# EasyEDA Pro project ProProject_nRF52840无线键盘_2024-02-15.epro, board PCB_JLC
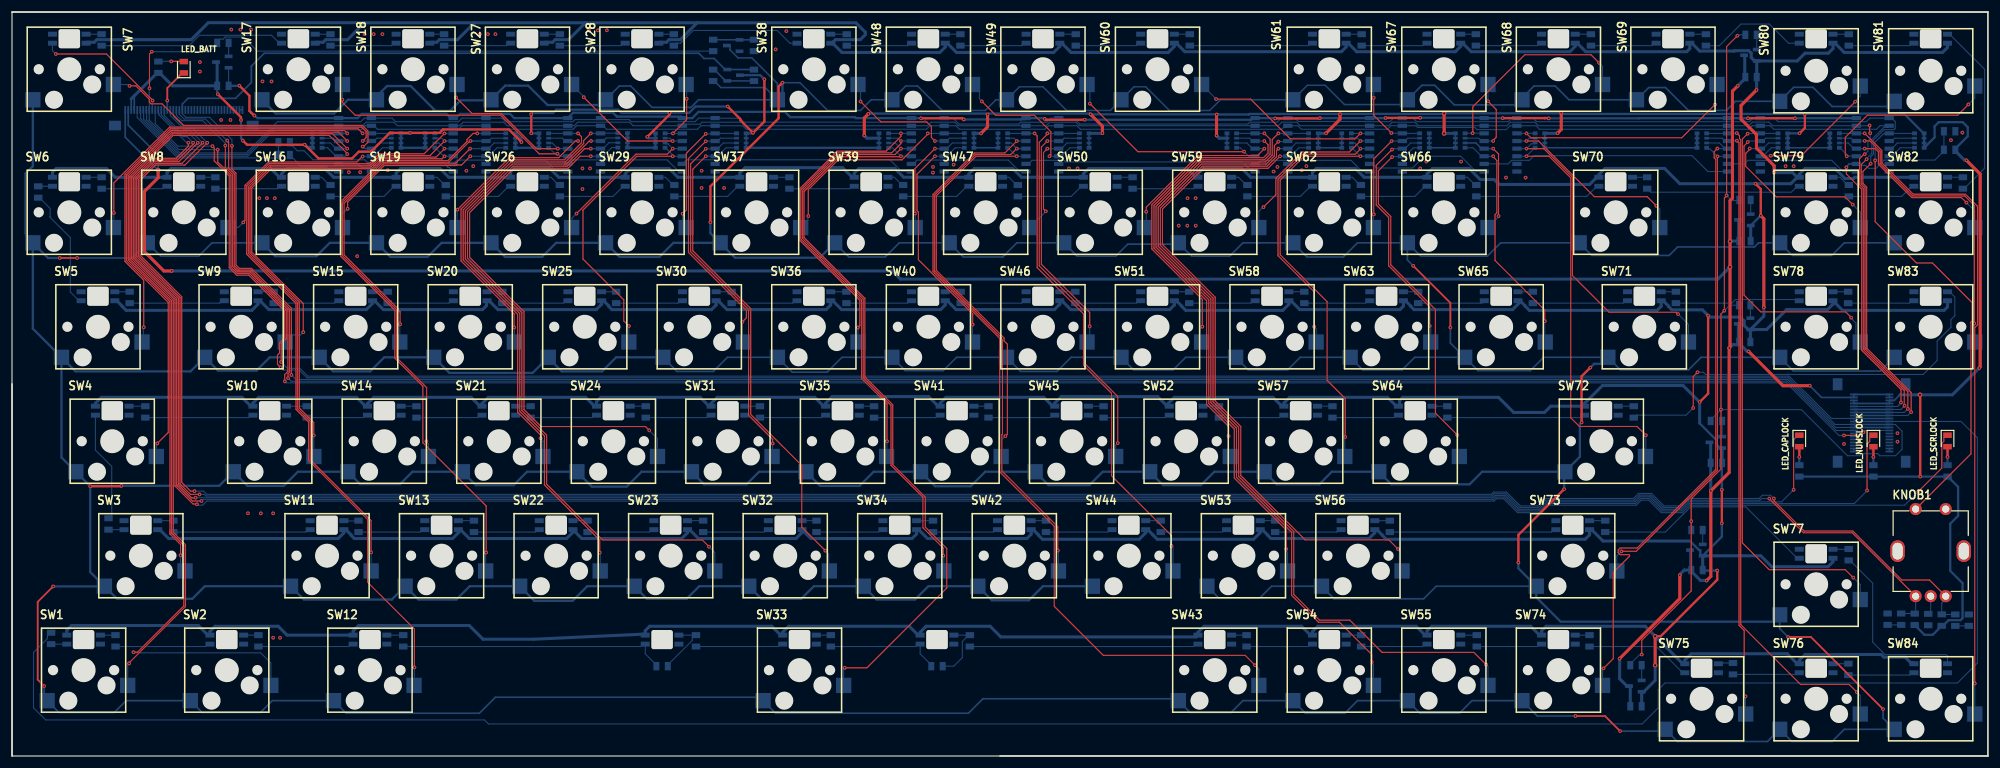
[diagram p14: board, top side]
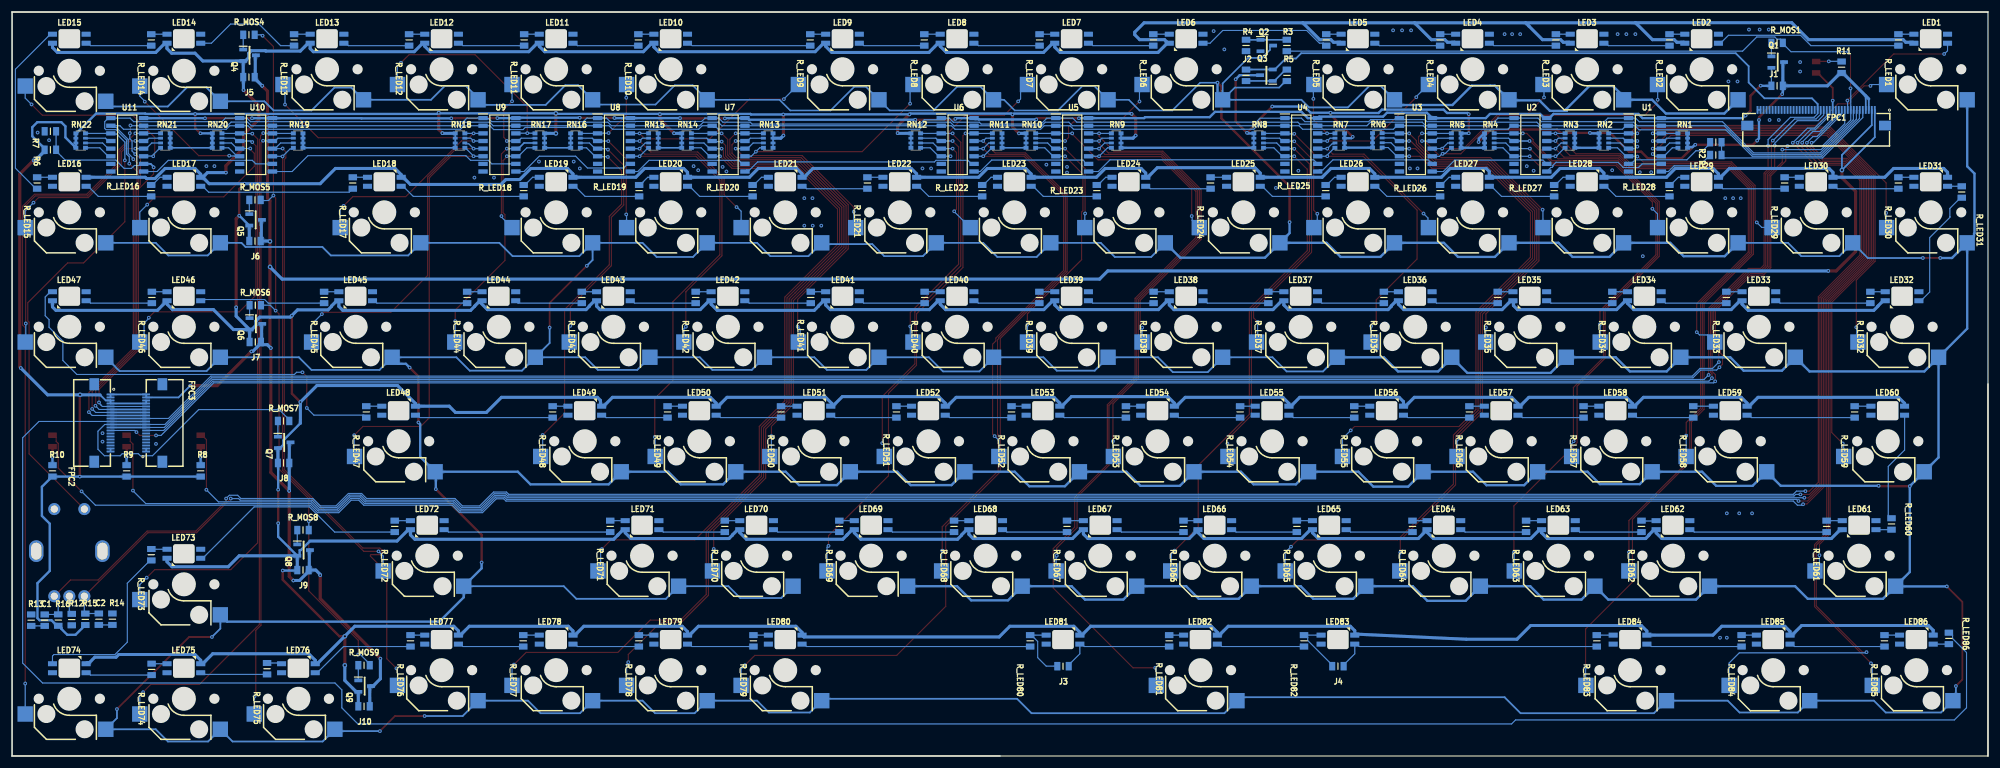
[diagram p15: board, bottom side, seen from below]

Outline 328.61 x 123.83 mm; copper layers: Top Layer, Bottom Layer. Coordinates in mm from the lower left corner of the outline.
Outline path: 0,123.83 328.61,123.83 ; 0,123.83 328.61,123.83 ; 0,123.83 0,0 ; 328.61,123.83 328.61,0 ; 328.61,123.83 328.61,0 ; 0,0 0,61.91 0,0 ; 0,0 328.61,0 ; 328.61,0 164.31,0 328.61,0
Stack: Top Layer 0.0356mm / Dielectric 1 1.1938mm FR-4 er 4.8 / Bottom Layer 0.0356mm

## Design rules (mm)
template: 自定义配置
spacing copperThickness1oz (default): track to track 0.102, other pairs 0.152 to 0.3
spacing copperThickness2oz: track to track 0.203, other pairs 0.152 to 0.3
spacing copperThicknessInner0.5oz: track to track 0.089, other pairs 0.152 to 0.3
track width copperThickness1oz (default): min 0.102, default 0.254, max 2.54
track width copperThickness2oz: min 0.203, default 0.254, max 2.54
track width copperThickness0.5oz: min 0.089, default 0.254, max 2.54
differential pair differentialPair (default): width min 0.127, default 0.254, max 2.54; gap min 0.152, default 0.152
via viaSize (default): diameter min 0.3, default 0.61, max 10; hole min 0.201, default 0.305, max 6.299

## Placement (name value [footprint] x y rotation side)
C1  1uF  [0805]  323.18 22.6 90 bottom
C2  1uF  [0805]  314.18 22.76 270 bottom
FPC1  -  [FPC_40P]  28.57 106.23 0 bottom
FPC2  -  [FPC_20P]  313.6 55.42 270 bottom
FPC3  -  [FPC_20P]  304.95 55.42 90 bottom
J1  0R  [0805]  35.07 111.54 180 bottom
J2  0R  [0805]  123.39 113.29 90 bottom
J3  0R  [0805]  153.83 14.95 0 bottom
J4  0R  [0805]  108.11 14.95 180 bottom
J5  0R  [0805]  289.21 112.99 180 bottom
J6  0R  [0805]  288.2 85.71 180 bottom
J7  0R  [0805]  288.15 68.9 180 bottom
J8  0R  [0805]  283.45 48.77 180 bottom
J9  0R  [0805]  280.22 30.94 180 bottom
J10  0R  [0805]  270.07 8.27 180 bottom
KNOB1  EC11_Knob  [EC11]  319.08 33.84 0 top
LED1  -  [WS2812_3528LED]  9.52 119.38 0 bottom
LED2  -  [WS2812_3528LED]  47.62 119.38 0 bottom
LED3  -  [WS2812_3528LED]  66.67 119.38 0 bottom
LED4  -  [WS2812_3528LED]  85.72 119.38 0 bottom
LED5  -  [WS2812_3528LED]  104.77 119.38 0 bottom
LED6  -  [WS2812_3528LED]  133.35 119.38 0 bottom
LED7  -  [WS2812_3528LED]  152.4 119.38 0 bottom
LED8  -  [WS2812_3528LED]  171.45 119.38 0 bottom
LED9  -  [WS2812_3528LED]  190.5 119.38 0 bottom
LED10  -  [WS2812_3528LED]  219.07 119.38 0 bottom
LED11  -  [WS2812_3528LED]  238.12 119.38 0 bottom
LED12  -  [WS2812_3528LED]  257.18 119.38 0 bottom
LED13  -  [WS2812_3528LED]  276.23 119.38 0 bottom
LED14  -  [WS2812_3528LED]  300.04 119.38 0 bottom
LED15  -  [WS2812_3528LED]  319.08 119.38 0 bottom
LED16  -  [WS2812_3528LED]  319.08 95.57 180 bottom
LED17  -  [WS2812_3528LED]  300.04 95.57 180 bottom
LED18  -  [WS2812_3528LED]  266.7 95.57 180 bottom
LED19  -  [WS2812_3528LED]  238.12 95.57 180 bottom
LED20  -  [WS2812_3528LED]  219.07 95.57 180 bottom
LED21  -  [WS2812_3528LED]  200.03 95.57 180 bottom
LED22  -  [WS2812_3528LED]  180.97 95.57 180 bottom
LED23  -  [WS2812_3528LED]  161.92 95.57 180 bottom
LED24  -  [WS2812_3528LED]  142.87 95.57 180 bottom
LED25  -  [WS2812_3528LED]  123.82 95.57 180 bottom
LED26  -  [WS2812_3528LED]  104.77 95.57 180 bottom
LED27  -  [WS2812_3528LED]  85.72 95.57 180 bottom
LED28  -  [WS2812_3528LED]  66.67 95.57 180 bottom
LED29  -  [WS2812_3528LED]  47.62 95.57 180 bottom
LED30  -  [WS2812_3528LED]  28.57 95.57 180 bottom
LED31  -  [WS2812_3528LED]  9.52 95.57 180 bottom
LED32  -  [WS2812_3528LED]  14.29 76.52 0 bottom
LED33  -  [WS2812_3528LED]  38.1 76.52 0 bottom
LED34  -  [WS2812_3528LED]  57.15 76.52 0 bottom
LED35  -  [WS2812_3528LED]  76.2 76.52 0 bottom
LED36  -  [WS2812_3528LED]  95.25 76.52 0 bottom
LED37  -  [WS2812_3528LED]  114.3 76.52 0 bottom
LED38  -  [WS2812_3528LED]  133.35 76.52 0 bottom
LED39  -  [WS2812_3528LED]  152.4 76.52 0 bottom
LED40  -  [WS2812_3528LED]  171.45 76.52 0 bottom
LED41  -  [WS2812_3528LED]  190.5 76.52 0 bottom
LED42  -  [WS2812_3528LED]  209.55 76.52 0 bottom
LED43  -  [WS2812_3528LED]  228.6 76.52 0 bottom
LED44  -  [WS2812_3528LED]  247.65 76.52 0 bottom
LED45  -  [WS2812_3528LED]  271.46 76.52 0 bottom
LED46  -  [WS2812_3528LED]  300.04 76.52 0 bottom
LED47  -  [WS2812_3528LED]  319.08 76.52 0 bottom
LED48  -  [WS2812_3528LED]  264.32 57.47 180 bottom
LED49  -  [WS2812_3528LED]  233.36 57.47 180 bottom
LED50  -  [WS2812_3528LED]  214.31 57.47 180 bottom
LED51  -  [WS2812_3528LED]  195.26 57.47 180 bottom
LED52  -  [WS2812_3528LED]  176.21 57.47 180 bottom
LED53  -  [WS2812_3528LED]  157.16 57.47 180 bottom
LED54  -  [WS2812_3528LED]  138.11 57.47 180 bottom
LED55  -  [WS2812_3528LED]  119.06 57.47 180 bottom
LED56  -  [WS2812_3528LED]  100.01 57.47 180 bottom
LED57  -  [WS2812_3528LED]  80.96 57.47 180 bottom
LED58  -  [WS2812_3528LED]  61.91 57.47 180 bottom
LED59  -  [WS2812_3528LED]  42.86 57.47 180 bottom
LED60  -  [WS2812_3528LED]  16.67 57.47 180 bottom
LED61  -  [WS2812_3528LED]  21.43 38.42 0 bottom
LED62  -  [WS2812_3528LED]  52.39 38.42 0 bottom
LED63  -  [WS2812_3528LED]  71.44 38.42 0 bottom
LED64  -  [WS2812_3528LED]  90.49 38.42 0 bottom
LED65  -  [WS2812_3528LED]  109.54 38.42 0 bottom
LED66  -  [WS2812_3528LED]  128.59 38.42 0 bottom
LED67  -  [WS2812_3528LED]  147.64 38.42 0 bottom
LED68  -  [WS2812_3528LED]  166.69 38.42 0 bottom
LED69  -  [WS2812_3528LED]  185.74 38.42 0 bottom
LED70  -  [WS2812_3528LED]  204.79 38.42 0 bottom
LED71  -  [WS2812_3528LED]  223.84 38.42 0 bottom
LED72  -  [WS2812_3528LED]  259.56 38.42 0 bottom
LED73  -  [WS2812_3528LED]  300.04 33.66 0 bottom
LED74  -  [WS2812_3528LED]  319.08 14.6 180 bottom
LED75  -  [WS2812_3528LED]  300.04 14.6 180 bottom
LED76  -  [WS2812_3528LED]  280.99 14.6 180 bottom
LED77  -  [WS2812_3528LED]  257.18 19.37 180 bottom
LED78  -  [WS2812_3528LED]  238.12 19.37 180 bottom
LED79  -  [WS2812_3528LED]  219.07 19.37 180 bottom
LED80  -  [WS2812_3528LED]  200.03 19.37 180 bottom
LED81  -  [WS2812_3528LED]  153.83 19.37 180 bottom
LED82  -  [WS2812_3528LED]  130.97 19.37 180 bottom
LED83  -  [WS2812_3528LED]  108.11 19.37 180 bottom
LED84  -  [WS2812_3528LED]  59.53 19.37 180 bottom
LED85  -  [WS2812_3528LED]  35.72 19.37 180 bottom
LED86  -  [WS2812_3528LED]  11.9 19.37 180 bottom
LED_BATT  -  [LED0805]  28.57 114.64 90 top
LED_CAPLOCK  -  [LED0805]  297.24 52.44 270 top
LED_NUMSLOCK  -  [LED0805]  309.56 52.44 270 top
LED_SCRLOCK  -  [LED0805]  321.88 52.44 270 top
Q1  AO3400  [SOT-23-3]  34.97 115.49 180 bottom
Q2  AO3400  [SOT-23-3]  119.94 118.24 180 bottom
Q3  AO3400  [SOT-23-3]  120 113.31 0 bottom
Q4  AO3400  [SOT-23-3]  289.11 116.63 180 bottom
Q5  AO3400  [SOT-23-3]  288.1 89.23 180 bottom
Q6  AO3400  [SOT-23-3]  288.05 71.92 180 bottom
Q7  AO3400  [SOT-23-3]  283.35 52.2 180 bottom
Q8  AO3400  [SOT-23-3]  280.12 34.27 180 bottom
Q9  AO3400  [SOT-23-3]  269.97 11.63 180 bottom
R1  0R  [0805]  45.26 100.03 180 bottom
R2  0R  [0805]  45.26 102.16 180 bottom
R3  100k  [0805]  116.61 118.26 270 bottom
R4  500k  [0805]  123.39 118.26 90 bottom
R5  100k  [0805]  116.6 113.29 270 bottom
R6  100k  [0805]  322.23 100.89 0 bottom
R7  100k  [0805]  322.23 103.98 180 bottom
R8  3k  [0805]  297.24 47.45 270 bottom
R9  3k  [0805]  309.56 47.45 270 bottom
R10  3k  [0805]  321.88 47.45 270 bottom
R11  3k  [0805]  24.34 114.64 270 bottom
R12  0R  [0805]  318.68 22.7 90 bottom
R13  0R  [0805]  325.43 22.6 90 bottom
R14  0R  [0805]  311.93 22.76 270 bottom
R15  10k  [0805]  316.43 22.75 90 bottom
R16  10k  [0805]  320.93 22.62 90 bottom
R_LED1  500R  [0805]  14.89 119.18 270 bottom
R_LED2  500R  [0805]  52.96 119.18 270 bottom
R_LED3  500R  [0805]  71.86 119.18 270 bottom
R_LED4  500R  [0805]  91.11 119.18 270 bottom
R_LED5  500R  [0805]  110.06 119.18 270 bottom
R_LED6  500R  [0805]  138.82 119.18 270 bottom
R_LED7  500R  [0805]  157.73 119.18 270 bottom
R_LED8  500R  [0805]  176.9 119.18 270 bottom
R_LED9  500R  [0805]  195.87 119.18 270 bottom
R_LED10  500R  [0805]  224.45 119.18 270 bottom
R_LED11  500R  [0805]  243.45 119.18 270 bottom
R_LED12  500R  [0805]  262.58 119.18 270 bottom
R_LED13  500R  [0805]  281.71 119.18 270 bottom
R_LED14  500R  [0805]  305.46 119.18 270 bottom
R_LED15  500R  [0805]  324.44 95.37 90 bottom
R_LED16  500R  [0805]  305.48 94.09 90 bottom
R_LED17  500R  [0805]  271.94 95.37 90 bottom
R_LED18  500R  [0805]  243.52 94.09 90 bottom
R_LED19  500R  [0805]  224.32 94.09 90 bottom
R_LED20  500R  [0805]  205.45 94.09 90 bottom
R_LED21  500R  [0805]  186.36 95.37 90 bottom
R_LED22  500R  [0805]  167.27 94.09 90 bottom
R_LED23  500R  [0805]  148.2 94.09 90 bottom
R_LED24  500R  [0805]  129.28 95.37 90 bottom
R_LED25  500R  [0805]  110.15 94.09 90 bottom
R_LED26  500R  [0805]  91.11 94.09 90 bottom
R_LED27  500R  [0805]  72.15 94.09 90 bottom
R_LED28  500R  [0805]  52.97 94.09 90 bottom
R_LED29  500R  [0805]  33.82 95.37 90 bottom
R_LED30  500R  [0805]  14.9 95.37 90 bottom
R_LED31  500R  [0805]  4.36 93.87 270 bottom
R_LED32  500R  [0805]  19.56 76.32 270 bottom
R_LED33  500R  [0805]  43.51 76.32 270 bottom
R_LED34  500R  [0805]  62.48 76.32 270 bottom
R_LED35  500R  [0805]  81.53 76.32 270 bottom
R_LED36  500R  [0805]  100.47 76.32 270 bottom
R_LED37  500R  [0805]  119.68 76.32 270 bottom
R_LED38  500R  [0805]  138.76 76.32 270 bottom
R_LED39  500R  [0805]  157.76 76.32 270 bottom
R_LED40  500R  [0805]  176.84 76.32 270 bottom
R_LED41  500R  [0805]  195.77 76.32 270 bottom
R_LED42  500R  [0805]  214.92 76.32 270 bottom
R_LED43  500R  [0805]  233.85 76.32 270 bottom
R_LED44  500R  [0805]  252.92 76.32 270 bottom
R_LED45  500R  [0805]  276.71 76.32 270 bottom
R_LED46  500R  [0805]  305.36 76.32 270 bottom
R_LED47  500R  [0805]  269.7 57.27 90 bottom
R_LED48  500R  [0805]  238.7 57.27 90 bottom
R_LED49  500R  [0805]  219.6 57.27 90 bottom
R_LED50  500R  [0805]  200.72 57.27 90 bottom
R_LED51  500R  [0805]  181.53 57.27 90 bottom
R_LED52  500R  [0805]  162.39 57.27 90 bottom
R_LED53  500R  [0805]  143.36 57.27 90 bottom
R_LED54  500R  [0805]  124.38 57.27 90 bottom
R_LED55  500R  [0805]  105.4 57.27 90 bottom
R_LED56  500R  [0805]  86.25 57.27 90 bottom
R_LED57  500R  [0805]  67.26 57.27 90 bottom
R_LED58  500R  [0805]  49.01 57.27 90 bottom
R_LED59  500R  [0805]  22.17 57.27 90 bottom
R_LED60  500R  [0805]  16.04 38.62 270 bottom
R_LED61  500R  [0805]  26.83 38.22 270 bottom
R_LED62  500R  [0805]  57.62 38.22 270 bottom
R_LED63  500R  [0805]  76.82 38.22 270 bottom
R_LED64  500R  [0805]  95.71 38.22 270 bottom
R_LED65  500R  [0805]  114.94 38.22 270 bottom
R_LED66  500R  [0805]  133.79 38.22 270 bottom
R_LED67  500R  [0805]  153.16 38.22 270 bottom
R_LED68  500R  [0805]  171.95 38.22 270 bottom
R_LED69  500R  [0805]  191.03 38.22 270 bottom
R_LED70  500R  [0805]  210.07 38.22 270 bottom
R_LED71  500R  [0805]  229.13 38.22 270 bottom
R_LED72  500R  [0805]  264.96 38.22 270 bottom
R_LED73  500R  [0805]  305.45 33.5 270 bottom
R_LED74  500R  [0805]  305.4 14.41 90 bottom
R_LED75  500R  [0805]  286.2 14.53 90 bottom
R_LED76  500R  [0805]  262.34 19.17 90 bottom
R_LED77  500R  [0805]  243.59 19.17 90 bottom
R_LED78  500R  [0805]  224.37 19.17 90 bottom
R_LED79  500R  [0805]  205.31 19.17 90 bottom
R_LED80  500R  [0805]  159.29 19.17 90 bottom
R_LED81  500R  [0805]  136.17 19.17 90 bottom
R_LED82  500R  [0805]  113.75 19.17 90 bottom
R_LED83  500R  [0805]  65.06 19.17 270 bottom
R_LED84  500R  [0805]  40.98 19.17 90 bottom
R_LED85  500R  [0805]  17.21 19.17 90 bottom
R_LED86  500R  [0805]  6.5 19.57 270 bottom
R_MOS1  100k  [0805]  35.07 118.69 0 bottom
R_MOS4  100k  [0805]  289.21 120.03 0 bottom
R_MOS5  100k  [0805]  288.2 92.55 0 bottom
R_MOS6  100k  [0805]  288.15 75.03 0 bottom
R_MOS7  100k  [0805]  283.45 55.76 0 bottom
R_MOS8  100k  [0805]  280.22 37.6 0 bottom
R_MOS9  100k  [0805]  270.07 15.11 0 bottom
RN1  排阻  [0603排阻]  50.76 102.43 90 bottom
RN2  排阻  [0603排阻]  63.88 102.43 270 bottom
RN3  排阻  [0603排阻]  69.53 102.43 90 bottom
RN4  排阻  [0603排阻]  82.92 102.43 270 bottom
RN5  排阻  [0603排阻]  88.43 102.43 90 bottom
RN6  排阻  [0603排阻]  101.55 102.47 270 bottom
RN7  排阻  [0603排阻]  107.81 102.43 90 bottom
RN8  排阻  [0603排阻]  121.29 102.43 270 bottom
RN9  排阻  [0603排阻]  144.98 102.43 90 bottom
RN10  排阻  [0603排阻]  159.18 102.43 270 bottom
RN11  排阻  [0603排阻]  164.77 102.43 90 bottom
RN12  排阻  [0603排阻]  178.32 102.43 270 bottom
RN13  排阻  [0603排阻]  202.85 102.43 90 bottom
RN14  排阻  [0603排阻]  216.43 102.43 270 bottom
RN15  排阻  [0603排阻]  221.94 102.43 90 bottom
RN16  排阻  [0603排阻]  234.9 102.43 270 bottom
RN17  排阻  [0603排阻]  240.85 102.43 90 bottom
RN18  排阻  [0603排阻]  254.11 102.43 270 bottom
RN19  200k  [0603排阻]  281.03 102.43 90 bottom
RN20  200k  [0603排阻]  294.5 102.43 270 bottom
RN21  200k  [0603排阻]  303.1 102.43 90 bottom
RN22  200k  [0603排阻]  317.2 102.43 270 bottom
SW1  MX Switch  [MX-Switch]  11.9 14.29 0 top
SW2  MX Switch  [MX-Switch]  35.72 14.29 0 top
SW3  MX Switch  [MX-Switch]  21.43 33.34 0 top
SW4  MX Switch  [MX-Switch]  16.67 52.39 0 top
SW5  MX Switch  [MX-Switch]  14.29 71.44 0 top
SW6  MX Switch  [MX-Switch]  9.52 90.49 0 top
SW7  MX Switch  [MX-Switch]  9.52 114.3 0 top
SW8  MX Switch  [MX-Switch]  28.57 90.49 0 top
SW9  MX Switch  [MX-Switch]  38.1 71.44 0 top
SW10  MX Switch  [MX-Switch]  42.86 52.39 0 top
SW11  MX Switch  [MX-Switch]  52.39 33.34 0 top
SW12  MX Switch  [MX-Switch]  59.53 14.29 0 top
SW13  MX Switch  [MX-Switch]  71.44 33.34 0 top
SW14  MX Switch  [MX-Switch]  61.91 52.39 0 top
SW15  MX Switch  [MX-Switch]  57.15 71.44 0 top
SW16  MX Switch  [MX-Switch]  47.62 90.49 0 top
SW17  MX Switch  [MX-Switch]  47.62 114.3 0 top
SW18  MX Switch  [MX-Switch]  66.67 114.3 0 top
SW19  MX Switch  [MX-Switch]  66.67 90.49 0 top
SW20  MX Switch  [MX-Switch]  76.2 71.44 0 top
SW21  MX Switch  [MX-Switch]  80.96 52.39 0 top
SW22  MX Switch  [MX-Switch]  90.49 33.34 0 top
SW23  MX Switch  [MX-Switch]  109.54 33.34 0 top
SW24  MX Switch  [MX-Switch]  100.01 52.39 0 top
SW25  MX Switch  [MX-Switch]  95.25 71.44 0 top
SW26  MX Switch  [MX-Switch]  85.72 90.49 0 top
SW27  MX Switch  [MX-Switch]  85.72 114.3 0 top
SW28  MX Switch  [MX-Switch]  104.77 114.3 0 top
SW29  MX Switch  [MX-Switch]  104.77 90.49 0 top
SW30  MX Switch  [MX-Switch]  114.3 71.44 0 top
SW31  MX Switch  [MX-Switch]  119.06 52.39 0 top
SW32  MX Switch  [MX-Switch]  128.59 33.34 0 top
SW33  MX Switch  [MX-Switch]  130.97 14.29 0 top
SW34  MX Switch  [MX-Switch]  147.64 33.34 0 top
SW35  MX Switch  [MX-Switch]  138.11 52.39 0 top
SW36  MX Switch  [MX-Switch]  133.35 71.44 0 top
SW37  MX Switch  [MX-Switch]  123.82 90.49 0 top
SW38  MX Switch  [MX-Switch]  133.35 114.3 0 top
SW39  MX Switch  [MX-Switch]  142.87 90.49 0 top
SW40  MX Switch  [MX-Switch]  152.4 71.44 0 top
SW41  MX Switch  [MX-Switch]  157.16 52.39 0 top
SW42  MX Switch  [MX-Switch]  166.69 33.34 0 top
SW43  MX Switch  [MX-Switch]  200.03 14.29 0 top
SW44  MX Switch  [MX-Switch]  185.74 33.34 0 top
SW45  MX Switch  [MX-Switch]  176.21 52.39 0 top
SW46  MX Switch  [MX-Switch]  171.45 71.44 0 top
SW47  MX Switch  [MX-Switch]  161.92 90.49 0 top
SW48  MX Switch  [MX-Switch]  152.4 114.3 0 top
SW49  MX Switch  [MX-Switch]  171.45 114.3 0 top
SW50  MX Switch  [MX-Switch]  180.97 90.49 0 top
SW51  MX Switch  [MX-Switch]  190.5 71.44 0 top
SW52  MX Switch  [MX-Switch]  195.26 52.39 0 top
SW53  MX Switch  [MX-Switch]  204.79 33.34 0 top
SW54  MX Switch  [MX-Switch]  219.07 14.29 0 top
SW55  MX Switch  [MX-Switch]  238.12 14.29 0 top
SW56  MX Switch  [MX-Switch]  223.84 33.34 0 top
SW57  MX Switch  [MX-Switch]  214.31 52.39 0 top
SW58  MX Switch  [MX-Switch]  209.55 71.44 0 top
SW59  MX Switch  [MX-Switch]  200.03 90.49 0 top
SW60  MX Switch  [MX-Switch]  190.5 114.3 0 top
SW61  MX Switch  [MX-Switch]  219.07 114.3 0 top
SW62  MX Switch  [MX-Switch]  219.07 90.49 0 top
SW63  MX Switch  [MX-Switch]  228.6 71.44 0 top
SW64  MX Switch  [MX-Switch]  233.36 52.39 0 top
SW65  MX Switch  [MX-Switch]  247.65 71.44 0 top
SW66  MX Switch  [MX-Switch]  238.12 90.49 0 top
SW67  MX Switch  [MX-Switch]  238.12 114.3 0 top
SW68  MX Switch  [MX-Switch]  257.18 114.3 0 top
SW69  MX Switch  [MX-Switch]  276.23 114.3 0 top
SW70  MX Switch  [MX-Switch]  266.7 90.49 0 top
SW71  MX Switch  [MX-Switch]  271.46 71.44 0 top
SW72  MX Switch  [MX-Switch]  264.32 52.39 0 top
SW73  MX Switch  [MX-Switch]  259.56 33.34 0 top
SW74  MX Switch  [MX-Switch]  257.18 14.29 0 top
SW75  MX Switch  [MX-Switch]  280.99 9.53 0 top
SW76  MX Switch  [MX-Switch]  300.04 9.53 0 top
SW77  MX Switch  [MX-Switch]  300.04 28.57 0 top
SW78  MX Switch  [MX-Switch]  300.04 71.44 0 top
SW79  MX Switch  [MX-Switch]  300.04 90.49 0 top
SW80  MX Switch  [MX-Switch]  300.04 114.05 0 top
SW81  MX Switch  [MX-Switch]  319.08 114.05 0 top
SW82  MX Switch  [MX-Switch]  319.08 90.49 0 top
SW83  MX Switch  [MX-Switch]  319.08 71.44 0 top
SW84  MX Switch  [MX-Switch]  319.08 9.53 0 top
U1  74HC165D  [SOIC-16]  57.05 101.72 180 bottom
U2  74HC165D  [SOIC-16]  76.1 101.72 180 bottom
U3  74HC165D  [SOIC-16]  95.15 101.72 180 bottom
U4  74HC165D  [SOIC-16]  114.2 101.72 180 bottom
U5  74HC165D  [SOIC-16]  152.3 101.72 180 bottom
U6  74HC165D  [SOIC-16]  171.35 101.72 180 bottom
U7  74HC165D  [SOIC-16]  209.45 101.72 180 bottom
U8  74HC165D  [SOIC-16]  228.5 101.72 180 bottom
U9  74HC165D  [SOIC-16]  247.55 101.72 180 bottom
U10  74HC165D  [SOIC-16]  288.03 101.72 180 bottom
U11  74HC165D  [SOIC-16]  309.46 101.72 180 bottom

## Footprints (pads in the part's own frame, mm; a bottom-side part is the same pattern mirrored in y, then rotated)
0603排阻
  rect 0.65x0.8 smd: 1(-1.2,-0.8) 4(1.2,-0.8) 5(1.2,0.8) 8(-1.2,0.8)
  rect 0.45x0.8 smd: 2(-0.4,-0.8) 3(0.4,-0.8) 6(0.4,0.8) 7(-0.4,0.8)
0805
  rect 1x1.4 smd: 1(-0.95,0) 2(0.95,0)
EC11
  round 2 hole 1.2: A(-2.5,-7.25) B(2.5,-7.25) C(0,-7.25) D(-2.5,7.25) E(2.5,7.25)
  oval 2.4x3.6 hole 1.7x2.8: MH1(-5.5,0.25) MH2(5.5,0.25)
FPC_20P
  rect 0.3x1.3 smd: 1(-4.75,1.367) 2(-4.25,1.367) 3(-3.75,1.367) 4(-3.25,1.367) 5(-2.75,1.367) 6(-2.25,1.367) 7(-1.75,1.367) 8(-1.25,1.367) 9(-0.75,1.367) 10(-0.25,1.367) 11(0.25,1.367) 12(0.75,1.367) 13(1.25,1.367) 14(1.75,1.367) 15(2.25,1.367) 16(2.75,1.367) 17(3.25,1.367) 18(3.75,1.367) 19(4.25,1.367) 20(4.75,1.367)
  rect 2x1.6 smd: 21(6.45,-1.339) 22(-6.45,-1.339)
FPC_40P
  rect 0.3x1.3 smd: 1(-9.75,-1.3) 2(-9.25,-1.3) 3(-8.75,-1.3) 4(-8.25,-1.3) 5(-7.75,-1.3) 6(-7.25,-1.3) 7(-6.75,-1.3) 8(-6.25,-1.3) 9(-5.75,-1.3) 10(-5.25,-1.3) 11(-4.75,-1.3) 12(-4.25,-1.3) 13(-3.75,-1.3) 14(-3.25,-1.3) 15(-2.75,-1.3) 16(-2.25,-1.3) 17(-1.75,-1.3) 18(-1.25,-1.3) 19(-0.75,-1.3) 20(-0.25,-1.3) 21(0.25,-1.3) 22(0.75,-1.3) 23(1.25,-1.3) 24(1.75,-1.3) 25(2.25,-1.3) 26(2.75,-1.3) 27(3.25,-1.3) 28(3.75,-1.3) 29(4.25,-1.3) 30(4.75,-1.3) 31(5.25,-1.3) 32(6.25,-1.3) 33(5.75,-1.3) 34(6.75,-1.3) 35(7.25,-1.3) 36(7.75,-1.3) 37(8.25,-1.3) 38(8.75,-1.3) 39(9.25,-1.3) 40(9.75,-1.3)
  rect 2x1.6 smd: 41(11.45,1.3) 42(-11.45,1.3)
LED0805
  rect 0.9x1.4 smd: 1(-0.95,0) 2(0.95,0)
MX-Switch
  rect 2.55x2.55 smd far side: 1(-6.066,-5.08) 2(7.335,-2.54)
SOIC-16
  rect 1.55x0.7 smd: 1(-2.725,4.445) 2(-2.725,3.175) 3(-2.725,1.905) 4(-2.725,0.635) 5(-2.725,-0.635) 6(-2.725,-1.905) 7(-2.725,-3.175) 8(-2.725,-4.445) 9(2.725,-4.445) 10(2.725,-3.175) 11(2.725,-1.905) 12(2.725,-0.635) 13(2.725,0.635) 14(2.725,1.905) 15(2.725,3.175) 16(2.725,4.445)
SOT-23-3
  rect 1.3x0.6 smd: 1(-1.05,0.95) 2(-1.05,-0.95) 3(1.05,0)
WS2812_3528LED
  rect 1.501x0.821 smd: 1(2.799,0.75) 2(2.799,-0.75) 3(-2.799,-0.75) 4(-2.799,0.75)

## Nets
As in the schematic.

Pads without a net: FPC1 21 22 23 24 25 26 27 28 29 30 31 32 33 34 35 36 37 38; FPC2 14 15 16 17 18; FPC3 3 4 5 6 7; U2 7; U3 7; U4 7; U5 7; U6 7; U7 7; U8 7; U9 7; U10 7; U11 7

## Via types
v1: diameter 0.61, hole 0.305, Top Layer to Bottom Layer, 370 vias
v2: diameter 0.762, hole 0.381, Top Layer to Bottom Layer, 8 vias

## Routing (per net, layer and track width the routed paths; a pad name or vN(x,y) marks a point on that pad's centre or on a via; arc(x,y) is an arc through that point)
GND: length 1.5
  Bottom Layer w0.254: FPC2.19 FPC2.20 ; FPC3.2 FPC3.1 ; FPC1.40 FPC1.39
  vias: v1(31.24,115.5) v1(31.24,113.92) v1(34.78,105.86) v1(36.32,105.86) v1(36.46,120.9) v1(37.97,120.9) v1(39.23,40.39) v1(39.75,120.9) v1(41.12,92.84) v1(41.37,40.39) v1(41.66,112.27) v1(42.39,92.84) v1(43.16,112.27) v1(43.43,40.39) v1(43.43,19.69) v1(43.69,92.84) v1(44.56,19.69) v1(56.01,97.16) v1(57.4,83.19) v1(57.9,97.16) v1(58.64,120.14) v1(60.14,120.14) v1(61.59,120.14) v1(62.49,97.49) v1(75.56,97.41) v1(76.71,98.17) v1(77.8,120.14) v1(79.14,120.14) v1(80.39,120.14) v1(94.87,97.79) v1(94.87,94.36) v1(95.94,120.78) v1(96.14,97.79) v1(97.44,120.78) v1(98.93,120.78) v1(114.68,97.41) v1(114.68,94.55) v1(118.42,94.55) v1(127,117.6) v1(128.78,120.65) v1(153.16,98.04) v1(153.16,97.1) v1(156.59,98.42) v1(175.77,97.79) v1(177.2,97.79) v1(194.03,88.27) v1(195.5,92.84) v1(195.45,88.27) v1(196.85,92.84) v1(196.85,88.27) v1(209.8,97.28) v1(210.44,98.04) v1(214.5,97.49) v1(215.26,98.17) v1(234.19,97.79) v1(235.2,98.93) v1(240.98,98.93) v1(248.46,96.27) v1(251.71,96.27) v1(294.95,98.17) v1(296.29,98.17) v1(304.67,51.94) v1(313.56,53.72) v1(313.56,52.32) v1(322.45,102.49) v1(324.36,103.76)
VCC3V3: length 663.1
  Top Layer w0.381: v1(109.35,107.06) 109.35,106.74 v1(105.65,103.05) ; v1(86.35,103.64) v1(86.35,106.82) ; v1(125.11,112.64) 125.11,105.61 v1(123.23,103.72) 123.16,103.8 123.15,103.8 121.11,105.83 121.11,106.02 v1(119.03,108.1) ; v1(317.34,46.5) 317.34,60.08 v2(317.3,60.12) ; v1(84.72,102.19) 82.63,104.27 71.66,104.27 71.09,103.7 v1(66.19,103.7) 62.81,103.7 59.68,100.58 57.67,100.58 56.55,99.46 50.96,99.46 v1(48.68,101.73) 39.08,101.73 v1(38.39,102.43) ; v1(298.16,106.85) 298.16,104.53 v1(297.28,103.64) ; v1(34.23,110.15) 38.07,106.31 38.07,105.87 v1(38.09,105.85)
  Top Layer w0.508: v1(161.15,103.63) 162.23,104.71 v1(162.23,106.77) ; v1(325.03,99.15) 327.32,96.85 327.32,64.76 327.16,64.6 v1(327.16,64.58) ; v1(200.32,103.27) 200.32,106.75 v1(200.34,106.77) ; v1(181.34,103.68) 181.34,104.83 v1(179.37,106.8) ; v2(238.17,106.96) 238.17,106.96 238.17,103.62 v2(238.17,103.61) ; v1(142.41,106.86) 141.74,106.2 v1(141.74,103.27) ; v1(257.04,103.67) 257.64,104.27 257.64,107.05 ; v1(218.51,103.64) 220.84,105.97 220.84,106.8 v1(220.86,106.82)
  Bottom Layer w0.254: RN16.1 RN16.2 RN16.3 RN16.4 RN17.1 RN17.2 RN17.3 RN17.4 ; RN9.1 RN9.2 RN9.3 RN9.4 ; RN10.1 RN10.2 RN10.3 RN10.4 163.97,101.23 163.97,103.63 ; RN18.1 RN18.2 RN18.3 RN18.4 RN19.1 ; RN20.4 RN21.1 ; RN8.4 RN8.3 RN8.2 RN8.1 ; RN13.4 RN13.3 RN13.2 202.05,101.63 ; RN14.1 RN14.2 RN14.3 RN14.4 RN15.1 RN15.2 RN15.3 RN15.4 ; RN12.1 RN12.2 RN12.3 RN12.4
  Bottom Layer w0.28: FPC1.3 19.82,109.37 ; FPC1.4 20.32,109.87 ; 313.96,60.11 313.04,59.18 312.24,59.18 FPC2.3 FPC2.4 FPC3.17 FPC3.18
  Bottom Layer w0.381: 297.31,46.5 R9.2 322.08,46.5 322.39,46.19 322.39,46.05 323.64,44.8 323.64,39.97 322.34,38.66 322.34,30.81 324.38,28.76 324.38,22.94 324.04,22.6 322.06,22.6 321.13,21.67 R16.1 320.73,21.67 320.42,21.36 320.42,21.16 319.43,20.17 318.05,20.17 316.94,21.29 316.94,21.49 316.63,21.8 R15.1 ; v1(220.86,106.82) 220.82,106.86 213.09,106.86 205.81,106.86 205.71,106.77 v1(200.34,106.77) ; v1(38.09,105.85) 38.09,102.79 38.39,102.49 v1(38.39,102.43) ; v1(86.35,103.64) 86.37,103.63 RN5.4 RN5.3 RN5.2 RN5.1 RN4.4 RN4.3 RN4.2 RN4.1 83.8,103.63 84.67,102.75 84.67,102.23 v1(84.72,102.19) ; J1.2 34.12,110.33 34.23,110.21 v1(34.23,110.15) ; v1(125.11,112.64) 124.45,113.31 Q3.3 ; RN3.4 RN3.3 RN3.2 RN3.1 64.68,101.23 64.68,103.63 66.12,103.63 v1(66.19,103.7) ; v1(142.41,106.86) 142.45,106.91 142.61,106.91 142.63,106.92 162.02,106.92 ; RN19.4 RN19.3 RN19.2 RN19.1 ; RN7.3 105.87,102.83 v1(105.65,103.05) ; RN7.3 RN7.4 ; RN7.3 RN7.2 RN7.1 106.99,101.25 102.37,101.25 RN6.4 RN6.3 RN6.2 RN6.1 ; RN8.1 123.07,103.63 123.17,103.72 v1(123.23,103.72) ; RN8.4 RN9.1 ; v1(119.03,108.1) 113.67,108.1 112.64,107.06 v1(109.35,107.06) 109.31,107.02 101.36,107.02 100.81,107.57 90.52,107.57 89.97,107.02 86.55,107.02 v1(86.35,106.82) ; RN1.4 RN1.3 RN1.2 RN1.1 49.83,101.36 49.11,101.36 48.74,101.73 v1(48.68,101.73) ; RN20.4 RN20.3 RN20.2 RN20.1 295.31,103.63 297.27,103.63 v1(297.28,103.64) ; RN21.1 RN21.2 RN21.3 RN21.4 ; 200.34,106.8 v1(179.37,106.8) 179.34,106.8 179.21,106.92 162.45,106.92 162.3,106.77 ; 220.86,106.75 220.97,106.86 220.98,106.86 220.99,106.88 237.99,106.88 238.07,106.96 257.46,106.96 257.58,107.08 257.7,107.08 257.93,106.86 298.15,106.86 v1(298.16,106.85) 298.17,106.86 306.4,106.86 306.46,106.92 314.63,106.92 317.92,103.63 RN22.1 RN22.2 RN22.3 RN22.4 318.07,101.23 318.27,101.42 318.27,101.5 319.73,102.96 319.73,104.8 320.42,105.49 324.4,105.49 325.25,104.65 325.25,103.15 323.18,101.09 R6.2
  Bottom Layer w0.508: RN13.3 200.76,102.83 v1(200.32,103.27) ; v1(325.03,99.15) 324.73,99.15 323.18,100.69 R6.2 ; 313.96,60.11 322.7,60.11 v1(327.16,64.58) ; 159.98,103.63 v1(161.15,103.63) ; 19.82,109.37 24.14,113.69 R11.2 24.54,113.69 26.69,111.54 J1.2 34.12,115.45 34.07,115.49 Q1.3 ; RN9.3 142.18,102.83 v1(141.74,103.27) ; 238.17,103.63 RN17.4 ; RN12.1 181.28,103.63 v1(181.34,103.68) ; RN18.1 257,103.63 v1(257.04,103.67) ; RN14.1 218.48,103.63 218.49,103.64 v1(218.51,103.64)
  vias: v1(257.64,107.08)
VCC5V: length 479.9
  Top Layer w0.508: v1(298.96,61.64) 294.5,61.64 v1(288.81,67.33) ; v1(277.36,30.09) 277.36,26.22 267.35,16.21 v1(267.35,16.2) ; v1(287,111.54) 286.12,110.66 286.12,92.84 285.72,92.44 v2(285.72,85.65) 285.72,68.08 285.57,67.93 v1(285.57,67.91) 285.57,47.18 v1(282.52,44.12) 282.52,29.89 v1(281.83,29.2) ; v1(26.56,80.74) 26.55,80.73 25.24,80.73 22.01,83.96 22.01,93.97 24.29,96.25 v2(24.29,97.52)
  Bottom Layer w0.28: FPC1.1 18.82,102.99 v2(24.29,97.52) 24.29,100.02 19.32,104.99 FPC1.2 ; 282.5,52.04 282.34,52.2 Q7.3 ; v1(298.96,61.64) 300.92,59.67 FPC3.19 FPC3.20 FPC2.1 FPC2.2
  Bottom Layer w0.508: J9.2 279.17,31.04 279.17,34.22 279.12,34.27 Q8.3 ; J9.2 278.1,30.94 277.38,30.23 277.38,30.11 v1(277.36,30.09) ; J9.2 279.27,30.74 280.79,29.22 281.81,29.22 v1(281.83,29.2) ; v1(287,111.54) 287.01,111.54 288.16,112.69 288.16,116.58 288.11,116.63 Q4.3 ; J10.2 269.12,11.59 269.07,11.63 Q9.3 268.57,11.63 267.35,12.85 v1(267.35,16.2) ; Q5.3 287.1,89.23 287.15,89.19 287.15,85.81 J6.2 285.77,85.71 v2(285.72,85.65) ; v2(285.7,81.39) 285.64,81.33 285.64,81.32 283.7,79.37 147.75,79.37 146.38,80.74 v1(26.56,80.74) ; v1(282.52,44.12) 282.51,44.14 282.51,48.76 J8.2 282.5,52.04 ; Q6.3 287.06,71.92 287.1,71.88 287.1,68.6 286.96,68.46 286.15,68.46 285.6,67.91 v1(285.57,67.91) ; 287.2,68.7 288.56,67.35 288.79,67.35 v1(288.81,67.33)
BATTERY_LED: length 7.4
  Top Layer w0.28: v1(25.82,109.08) 25.82,111.18 27.96,113.33 28.32,113.69 LED_BATT.1
  Bottom Layer w0.28: FPC1.15 25.82,109.08 v1(25.82,109.08)
CAP_LOCK: length 358.2
  Top Layer w0.178: v1(30.54,42.99) 30.51,42.96 29.88,42.96 27.66,45.18 27.66,76.2 20.74,83.12 20.74,96.03 23.62,98.91 27.75,98.91 v1(30.9,102.06) ; LED_CAPLOCK.1 296.99,53.39 296.62,53.03 296.62,53 296.29,52.67 v1(296.29,44.3)
  Bottom Layer w0.178: FPC1.14 25.32,106.59 27.99,103.93 29.14,103.93 30.9,102.18 v1(30.9,102.06) ; v1(296.29,44.3) 294.28,42.3 278.81,42.3 277.57,41.06 274.51,41.06 272.43,43.14 270.72,43.14 269.88,42.3 255.18,42.3 253.94,41.06 250.61,41.06 248.3,43.37 246.61,43.37 246.23,42.99 v1(30.54,42.99)
CE#: length 357.2
  Top Layer w0.178: v1(314.74,58.29) 314.69,58.34 314.69,60.85 307.88,67.67 307.88,94.46 307.25,95.08 307.25,99.41 308.01,100.17 v1(308.12,100.17) ; v1(309.03,103.66) 308.92,103.78 v1(308.92,104.94)
  Bottom Layer w0.178: v1(309.03,103.66) 309.03,102.75 308.65,102.38 308.65,100.7 v1(308.12,100.17) ; v1(314.74,58.29) 314.12,57.67 FPC2.6 ; FPC1.7 21.89,107.47 21.89,105.99 27.78,100.1 39.07,100.1 43.87,104.9 58.31,104.9 58.9,105.49 63.48,105.49 64.08,104.9 74.44,104.9 75.04,105.49 81.76,105.49 82.35,104.9 93.5,104.9 94.09,105.49 102.69,105.49 103.28,104.9 111.47,104.9 111.73,105.16 114.44,105.16 114.77,105.49 121.32,105.49 121.91,104.9 152.27,104.9 152.86,105.49 156.77,105.49 157.37,104.9 171.97,104.9 172.57,105.49 176.9,105.49 177.49,104.9 210.57,104.9 211.16,105.49 213.65,105.49 214.24,104.9 228.93,104.9 229.52,105.49 233.3,105.49 233.89,104.9 248.6,104.9 249.19,105.49 253.24,105.49 253.83,104.9 288.84,104.9 289.45,105.51 292.18,105.51 292.79,104.9 308.87,104.9 v1(308.92,104.94)
  Bottom Layer w0.28: FPC3.15 FPC2.6
CP: length 363.8
  Top Layer w0.178: v1(315.29,57.76) 315.29,60.65 308.15,67.78 308.15,94.57 307.53,95.2 307.53,98.43 v1(308.44,99.34)
  Bottom Layer w0.178: v1(308.44,99.34) 308.44,99.45 309.29,100.3 309.29,102.62 311.31,104.64 311.92,104.64 312.18,104.9 310.66,104.9 310.07,104.31 292.98,104.31 292.39,104.9 289.38,104.9 288.79,104.31 254.03,104.31 253.44,104.9 249.14,104.9 248.49,104.25 243.63,104.25 243.27,104.62 233.77,104.62 233.49,104.9 229.33,104.9 228.74,104.31 214.43,104.31 213.84,104.9 212.17,104.9 211.91,104.64 211.48,104.64 211.15,104.31 177.69,104.31 177.09,104.9 172.37,104.9 171.78,104.31 157.56,104.31 156.97,104.9 152.66,104.9 152.07,104.31 122.11,104.31 121.52,104.9 114.57,104.9 113.98,104.31 98.89,104.31 98.3,104.9 93.89,104.9 93.3,104.31 79.84,104.31 79.25,104.9 74.84,104.9 74.25,104.31 60.79,104.31 60.2,104.9 58.7,104.9 58.02,104.22 43.59,104.22 39.19,99.82 27.66,99.82 21.39,106.09 21.39,107.47 FPC1.6 ; v1(315.29,57.76) 314.7,57.17 FPC2.7
  Bottom Layer w0.28: FPC3.14 FPC2.7
KNOB_A: length 379.8
  Top Layer w0.178: KNOB1.A 306.02,37.16 297.92,37.16 292.25,42.83 v1(292.25,42.84) ; 31.69,102.06 28.27,98.63 23.73,98.63 21.02,95.92 21.02,83.24 27.94,76.32 27.94,45.29 29.7,43.53 v1(31.19,43.53)
  Bottom Layer w0.178: 31.69,102.06 29.54,104.21 28.73,104.21 26.32,106.62 FPC1.16 ; v1(292.25,42.84) 290.94,42.84 290.67,42.58 278.69,42.58 277.46,41.34 274.62,41.34 272.55,43.42 270.6,43.42 269.76,42.58 255.06,42.58 253.83,41.34 250.72,41.34 248.42,43.65 246.5,43.65 246.12,43.27 32.27,43.27 32,43.53 v1(31.19,43.53) ; C2.1 316.41,23.71 R15.2 316.58,23.86 KNOB1.A
  vias: v1(31.68,102.06)
KNOB_B: length 385.9
  Top Layer w0.178: v1(32.46,102.06) 28.75,98.36 23.85,98.36 21.3,95.8 21.3,83.35 28.22,76.43 28.22,45.55 29.68,44.08 v1(30.36,44.08) ; v1(293.01,42.84) 293.05,42.81 293.05,42.43 298.04,37.44 306.14,37.44 307.98,35.6 314.29,29.29 318.89,29.29 KNOB1.B
  Bottom Layer w0.178: C1.2 320.94,23.55 R16.2 320.93,25.46 321.58,26.12 KNOB1.B ; v1(293.01,42.84) 293.01,42.85 292.47,43.39 291.09,43.39 290.55,42.86 278.58,42.86 277.34,41.62 274.74,41.62 272.66,43.69 270.49,43.69 269.65,42.86 254.95,42.86 253.71,41.62 250.84,41.62 248.53,43.93 246.38,43.93 246,43.55 32.38,43.55 31.85,44.08 v1(30.36,44.08) ; v1(32.46,102.06) 30.03,104.49 28.85,104.49 26.82,106.51 FPC1.17
KNOB_SW: length 80.4
  Top Layer w0.178: v1(309.85,99.14) 309.85,88.92 316.7,82.06 319.36,82.06 325.98,75.44 325.98,72.41 325.78,72.21 325.78,50.29 KNOB1.D
  Bottom Layer w0.178: v1(309.85,99.14) 309.85,102.18 311.18,103.51 312.07,103.51 U11.3 RN22.8
LED_CONTROL: length 491.2
  Top Layer w0.178: v1(44.66,64.7) 44.14,65.21 44.14,66.71 44.48,67.05 44.48,68.76 45.32,69.59 45.32,74.08 39.37,80.03 37.36,80.03 36.12,81.27 36.12,96.54 33.63,99.04 33.63,101.18 33.34,101.47 v1(33.34,101.5) ; v1(271.03,16.89) 271.03,19.26 279.26,27.48 v1(279.26,39.08) 279.26,42.81 284.21,47.76 284.21,73.56 v1(284.77,74.13) 284.77,92.85 285.14,93.22 285.14,118.08 v1(286.94,119.88)
  Bottom Layer w0.178: v1(271.03,16.89) 270.7,16.89 269.12,15.31 R_MOS9.1 ; R_MOS8.1 279.26,37.61 v1(279.26,39.08) ; FPC2.11 313.2,55.17 314.32,54.05 314.32,51.05 313.24,49.97 310.62,49.97 310.28,50.32 307.61,50.32 307.26,49.97 305.25,49.97 297.57,57.65 v1(284.21,57.65) 284.18,57.65 282.5,55.96 R_MOS7.1 ; R_MOS4.1 287.21,120.03 287.06,119.88 v1(286.94,119.88) ; v1(33.34,101.5) 27.56,101.5 23.82,105.23 FPC1.11 ; v1(284.77,74.13) 285.67,75.03 R_MOS6.1 ; v1(285.14,93.29) 285.98,92.45 287.14,92.45 R_MOS5.1 ; FPC3.10 303.19,55.17 295.42,62.94 49.06,62.94 47.77,64.23 45.13,64.23 v1(44.66,64.7)
  Bottom Layer w0.28: FPC3.10 FPC2.11
LED_VCC: length 2098.1
  Top Layer w0.381: v1(283.59,30.86) 283.59,29.34 274.18,19.92 v2(273.25,19.92) ; v1(282.07,73.28) 282.07,60.32 v1(280.66,58.91) ; v1(290.83,89.92) 290.83,94.36 v1(289.94,95.25) ; v1(284.35,38.74) v1(284.35,44.32)
  Top Layer w0.508: v1(290.83,89.92) 291.34,89.41 v1(291.34,74.68) ; v2(273.27,15.09) 273.26,15.1 273.26,19.92 v2(273.25,19.92) ; v1(290.11,110.84) 287.55,108.28 287.55,105.98 290.11,103.42 290.11,101.17 293.05,98.24 v1(293.05,97.1)
  Bottom Layer w0.381: v1(290.83,89.92) 290.78,89.92 Q5.2 ; v1(284.35,44.32) 284.35,48.73 J8.1 ; 282.1,73.28 282.07,73.28 v1(282.07,73.28) ; 284.05,51.25 283.48,51.82 283.48,52.55 280.66,55.37 ; v1(283.59,30.86) 281.25,30.86 J9.1 ; 279.06,35.78 280.57,34.27 280.77,34.27 280.77,33.43 280.88,33.32 Q8.2 284.35,36.5 v1(284.35,38.74)
  Bottom Layer w0.508: 279.06,35.78 264.59,35.78 262.69,37.67 LED72.1 262.35,36.8 261.62,36.07 228.56,36.07 227.85,36.77 227.85,36.79 226.98,37.67 LED71.1 226.64,37.15 225.68,36.19 209.37,36.19 208.8,36.76 208.8,36.79 207.93,37.67 LED70.1 207.59,37.18 206.47,36.07 190.45,36.07 189.75,36.77 189.75,36.79 188.88,37.67 LED69.1 188.54,37.15 187.45,36.07 171.37,36.07 170.7,36.74 170.7,36.79 169.83,37.67 LED68.1 169.49,36.9 168.78,36.19 152.25,36.19 150.78,37.67 LED67.1 150.44,36.95 149.68,36.19 132.84,36.19 131.39,37.65 ; 113.94,122.03 140.34,122.03 141.9,120.47 141.9,120.05 141.07,119.22 136.94,119.22 136.65,118.93 136.65,118.79 136.49,118.63 ; 113.94,122.03 111.13,119.22 109.28,119.22 108.84,118.79 107.73,118.79 LED5.1 ; 113.94,122.03 95.37,122.03 ; 296.9,96.32 296.11,97.1 v1(293.05,97.1) ; 296.9,96.32 295.83,95.25 v1(289.94,95.25) 277.37,95.25 274.83,97.79 264.92,97.79 263.9,96.77 LED18.1 263.56,96.32 262.37,95.12 247.31,95.12 246.48,95.95 244.17,95.95 242.33,97.79 236.24,97.79 235.33,96.88 LED19.1 224.87,96.32 223.4,97.79 216.92,97.79 216.28,97.15 LED20.1 205.98,96.32 204.51,97.79 198.12,97.79 197.23,96.9 LED21.1 196.89,96.32 195.41,97.79 179.07,97.79 178.18,96.9 LED22.1 167.88,96.32 166.41,97.79 160.04,97.79 159.13,96.88 LED23.1 148.28,96.32 146.81,97.79 140.84,97.79 140.08,97.02 LED24.1 139.74,96.32 138.14,97.92 121.92,97.92 121.03,97.02 LED25.1 110.73,96.32 109.26,97.79 102.87,97.79 101.98,96.9 LED26.1 90.91,96.32 89.44,97.79 83.45,97.79 82.92,97.26 82.92,96.32 72.63,96.32 71.16,97.79 64.64,97.79 63.88,97.02 LED28.1 53.47,96.32 52,97.79 45.72,97.79 44.83,96.89 LED29.1 44.48,96.32 43.01,97.79 26.43,97.79 25.77,97.13 LED30.1 17.16,96.32 15.69,97.79 7.37,97.79 6.72,97.15 LED31.1 ; 296.9,96.32 LED17.1 297.24,96.83 298.2,97.79 303.15,97.79 304.84,96.11 306.24,96.11 306.45,96.32 LED16.1 ; 290.16,115.68 289.81,115.68 289.24,116.25 289.24,116.97 288.82,117.4 286.47,117.4 286.4,117.32 280.67,117.32 279.36,118.63 LED13.1 279.02,117.73 278.51,117.22 261.72,117.22 260.31,118.63 LED12.1 259.97,118.12 259.08,117.22 242.67,117.22 241.26,118.63 LED11.1 240.92,118.12 240.03,117.22 223.62,117.22 222.21,118.63 LED10.1 221.87,118 221.09,117.22 195.05,117.22 193.64,118.63 LED9.1 193.3,118.12 192.28,117.09 176.13,117.09 174.59,118.63 LED8.1 174.25,118.12 173.23,117.09 157.08,117.09 155.54,118.63 LED7.1 155.2,117.99 154.31,117.09 138.03,117.09 136.49,118.63 ; 290.16,115.68 J5.1 290.13,112.96 290.13,110.86 v1(290.11,110.84) ; 290.16,115.68 296.89,115.68 298.19,116.97 302.07,116.97 302.85,117.76 302.85,118.62 LED14.1 303.17,118.63 304.71,117.09 321.06,117.09 321.88,117.92 LED15.1 ; LED2.1 50.58,118.79 51.74,118.79 52.18,119.22 55.8,119.22 58.62,122.05 ; 58.62,122.05 58.63,122.03 76.88,122.03 ; 58.62,122.05 32.63,122.05 29.81,119.22 14.11,119.22 13.68,118.79 12.48,118.79 12.32,118.63 ; v1(291.34,74.68) 291.34,73.21 Q6.2 ; LED32.1 17.43,75.77 18.3,74.89 18.3,74.85 18.99,74.17 39.88,74.17 40.9,75.19 LED33.1 41.24,75.77 42.71,74.3 58.91,74.3 59.95,75.33 LED34.1 60.29,75.77 61.76,74.3 78.24,74.3 78.92,74.97 78.92,75.69 LED35.1 79.34,75.77 80.81,74.3 97.16,74.3 98.05,75.19 LED36.1 98.39,75.77 99.24,74.92 99.24,74.82 99.77,74.3 116.33,74.3 117.1,75.06 LED37.1 117.44,75.77 118.91,74.3 135.38,74.3 136.15,75.06 LED38.1 136.49,75.77 137.96,74.3 154.43,74.3 155.2,75.06 LED39.1 155.54,75.77 157.01,74.3 173.35,74.3 174.25,75.19 LED40.1 174.59,75.77 176.06,74.3 192.53,74.3 193.3,75.06 LED41.1 193.64,75.77 194.51,74.89 194.51,74.85 195.2,74.17 211.33,74.17 212.35,75.19 212.35,75.77 212.69,75.77 214.16,74.3 230.82,74.3 231.4,74.88 LED43.1 231.74,75.77 232.61,74.89 232.61,74.83 233.15,74.3 249.56,74.3 250.74,75.48 LED44.1 250.79,75.77 251.66,74.89 251.66,74.85 252.35,74.17 273.6,74.17 274.26,74.83 LED45.1 274.6,75.77 275.48,74.89 275.48,74.83 276.06,74.25 281.13,74.25 282.1,73.28 282.34,73.05 287.41,73.05 287.99,72.47 287.99,72.46 288.06,72.39 288.06,71.67 288.75,70.97 Q6.2 ; LED61.1 24.57,37.67 26.04,36.19 54.24,36.19 55.19,37.14 LED62.1 55.53,37.67 56.4,36.8 56.4,36.72 56.92,36.19 73.28,36.19 74.27,37.19 74.27,37.63 LED63.1 74.58,37.67 76.05,36.19 92.24,36.19 93.29,37.25 93.29,37.65 ; LED4.1 88.68,118.79 89.89,118.79 90.33,119.22 92.56,119.22 95.37,122.03 ; LED47.1 321.88,74.74 321.31,74.17 304.44,74.17 LED46.1 302.83,75.2 301.93,74.3 295.12,74.3 291.8,70.97 Q6.2 ; J7.1 Q6.2 ; 76.88,122.03 76.34,121.5 76.34,121.48 74.09,119.22 71.07,119.22 70.64,118.79 69.63,118.79 69.47,118.63 ; 76.88,122.03 95.37,122.03 ; LED64.1 93.29,37.65 ; 93.29,37.65 94.74,36.19 111.38,36.19 112.34,37.15 LED65.1 112.68,37.67 114.15,36.19 130.38,36.19 131.39,37.2 131.39,37.65 ; LED6.1 136.49,118.63 ; J8.1 Q7.2 284.05,51.25 ; 131.39,37.65 LED66.1 ; LED74.1 316.13,15.51 315.77,15.51 314.85,16.44 311.32,16.44 310.86,16.89 298.2,16.89 297.24,15.93 LED75.1 296.9,15.35 295.23,17.02 279.27,17.02 278.19,15.93 LED76.1 277.85,15.35 271.61,21.59 255.14,21.59 254.38,20.82 254.38,20.12 254.04,20.12 252.56,21.59 236.11,21.59 235.33,20.81 235.33,20.12 234.99,20.12 233.51,21.59 217.17,21.59 216.28,20.7 216.28,20.12 215.94,20.12 214.46,21.59 198.25,21.59 197.23,20.57 197.23,20.12 196.92,19.81 164.44,19.81 162.66,21.59 152.02,21.59 151.03,20.6 151.03,20.12 150.69,20.12 149.22,21.59 129.16,21.59 128.17,20.6 128.17,20.12 127.83,20.12 126.36,21.59 106.05,21.59 105.31,20.85 105.31,20.12 105.12,20.29 86.73,19.43 78.33,19.43 76.04,21.72 57.66,21.72 56.73,20.79 56.73,20.12 45.74,20.12 44.26,21.59 33.78,21.59 32.92,20.73 32.92,20.12 32.58,20.12 30.98,21.72 9.91,21.72 9.11,20.92 9.11,20.12 ; J9.1 Q8.2 290.83,33.32 292.65,31.5 302.01,31.5 302.83,32.32 LED73.1 ; LED60.1 13.87,58.7 14.86,59.69 38.25,59.69 39.72,58.22 LED59.1 40.06,58.73 41.02,59.69 57.3,59.69 58.77,58.22 LED58.1 59.11,58.65 60.15,59.69 76.35,59.69 77.82,58.22 LED57.1 78.16,58.65 79.2,59.69 95.4,59.69 96.87,58.22 LED56.1 97.21,58.99 97.92,59.69 114.45,59.69 115.92,58.22 LED55.1 116.26,58.69 117.27,59.69 133.5,59.69 134.97,58.22 LED54.1 135.31,58.73 136.4,59.82 152.42,59.82 154.02,58.22 LED53.1 154.36,58.73 155.32,59.69 171.6,59.69 173.07,58.22 LED52.1 173.41,58.73 174.5,59.82 190.52,59.82 192.12,58.22 LED51.1 192.28,58.4 192.28,58.67 193.29,59.69 209.7,59.69 211.17,58.22 LED50.1 211.51,58.73 212.47,59.69 228.75,59.69 230.22,58.22 LED49.1 230.76,58.41 230.76,59.18 231.27,59.69 247.22,59.69 249.74,57.17 254.85,57.17 255.9,58.22 LED48.1 261.52,58.67 264.5,61.66 277.9,61.66 v1(280.66,58.91) 280.66,55.37 ; J6.1 Q5.2 ; J10.1 271.02,10.68 271.37,10.68 273.27,12.58 v2(273.27,15.09)
LEFT_CON: length 319.7
  Top Layer w0.178: v1(45.91,62.89) 45.89,62.91 45.89,63.63 46.16,63.89 46.16,74.43 39.72,80.87 37.71,80.87 36.96,81.61 36.96,96.89 36.02,97.83 36.02,101.83 36.02,101.83 36.02,102.11 35.79,102.34 v1(35.79,102.43)
  Bottom Layer w0.178: v1(35.79,102.43) 35.75,102.43 32.16,106.02 28.6,106.02 27.82,106.8 FPC1.19 ; v1(45.91,62.89) 46.42,62.38 295.19,62.38 303.4,54.17 FPC3.8
MOS_CONTROL: length 433.5
  Top Layer w0.178: v1(34.21,100.92) 34.21,98.86 36.4,96.66 36.4,81.38 37.47,80.31 39.49,80.31 45.6,74.2 45.6,69.48 44.76,68.64 44.76,65.58 v1(44.75,65.56) ; v1(23.24,117.22) 22.86,116.84 v1(22.86,111.12)
  Bottom Layer w0.178: v1(44.75,65.56) 45.81,64.51 47.89,64.51 49.17,63.22 295.54,63.22 302.59,56.17 FPC3.12 ; v1(22.86,111.12) 22.82,111.09 FPC1.9 22.82,105.84 27.74,100.92 v1(34.21,100.92) ; R3.2 40.81,117.31 38.45,119.67 35.45,119.67 35.09,119.3 34.53,119.3 34.12,118.89 R_MOS1.1 34.12,118.57 32.77,117.22 v1(23.24,117.22)
  Bottom Layer w0.28: FPC3.12 FPC2.9
NETC1_1: length 2.3
  Bottom Layer w0.178: C1.1 R13.1
NETC2_2: length 2.2
  Bottom Layer w0.178: R14.2 C2.2
NETJ2_1: length 7.6
  Bottom Layer w0.254: R5.1 116.8,114.24 118.43,112.6 118.43,112.53 118.6,112.36 Q3.1 123.37,112.36 J2.1
NETJ3_1: length 19.5
  Bottom Layer w0.178: J3.1 152.88,15.15 151.03,17 LED81.2 150.69,18.62 150.29,18.22 R_LED81.1
NETJ3_2: length 10.9
  Bottom Layer w0.178: J3.2 156.62,14.95 158.04,16.37 158.04,19.06 159.09,20.12 ; 159.09,20.12 156.63,20.12 ; 159.09,20.12 R_LED80.2 159.49,20.12
NETJ4_1: length 9.9
  Bottom Layer w0.178: 113.55,20.12 113.14,19.71 113.14,19.23 109.06,15.15 J4.1 ; 113.55,20.12 110.91,20.12 ; 113.55,20.12 R_LED82.2
NETJ4_2: length 44.9
  Bottom Layer w0.178: R_LED83.2 104.57,18.22 104.97,18.62 LED83.2 105.31,17 107.16,15.15 J4.2
NETKNOB1_C: length 3.1
  Bottom Layer w0.178: KNOB1.C 319.08,24.06 R12.2
NETLED1_2: length 2.6
  Bottom Layer w0.178: 12.32,120.13 R_LED1.1
NETLED2_2: length 2.5
  Bottom Layer w0.178: LED2.2 R_LED2.1
NETLED2_4: length 31.2
  Bottom Layer w0.178: LED2.4 44.49,118.63 43.17,119.95 31.17,119.95 29.45,118.23 R_LED1.2
NETLED3_2: length 2.4
  Bottom Layer w0.178: 69.47,120.13 R_LED3.1
NETLED3_4: length 11.1
  Bottom Layer w0.178: R_LED2.2 63.13,118.23 63.53,118.63 LED3.4
NETLED4_2: length 2.6
  Bottom Layer w0.178: LED4.2 R_LED4.1
NETLED4_4: length 11.2
  Bottom Layer w0.178: R_LED3.2 82.18,118.23 82.58,118.63 LED4.4
NETLED5_2: length 2.5
  Bottom Layer w0.178: LED5.2 R_LED5.1
NETLED5_4: length 11
  Bottom Layer w0.178: R_LED4.2 101.23,118.23 101.63,118.63 LED5.4
NETLED6_2: length 2.7
  Bottom Layer w0.178: LED6.2 R_LED6.1
NETLED6_4: length 22.4
  Bottom Layer w0.178: R_LED5.2 110.47,118.64 111.18,118.64 113.3,120.75 127.25,120.75 129.38,118.63 130.55,118.63
NETLED7_2: length 2.5
  Bottom Layer w0.178: LED7.2 R_LED7.1
NETLED7_4: length 11
  Bottom Layer w0.178: R_LED6.2 148.86,118.23 149.26,118.63 LED7.4
NETLED8_2: length 2.7
  Bottom Layer w0.178: LED8.2 R_LED8.1
NETLED8_4: length 11.1
  Bottom Layer w0.178: 168.65,118.63 168.31,118.63 167.91,118.23 R_LED7.2
NETLED9_2: length 2.6
  Bottom Layer w0.178: LED9.2 R_LED9.1
NETLED9_4: length 11
  Bottom Layer w0.178: R_LED8.2 186.96,118.23 187.36,118.63 LED9.4
NETLED10_2: length 2.6
  Bottom Layer w0.178: LED10.2 R_LED10.1
NETLED10_4: length 20.6
  Bottom Layer w0.178: R_LED9.2 215.53,118.23 215.94,118.63 LED10.4
NETLED11_2: length 2.5
  Bottom Layer w0.178: LED11.2 R_LED11.1
NETLED11_4: length 11
  Bottom Layer w0.178: R_LED10.2 234.58,118.23 234.99,118.63 LED11.4
NETLED12_2: length 2.6
  Bottom Layer w0.178: LED12.2 R_LED12.1
NETLED12_4: length 11.1
  Bottom Layer w0.178: LED12.4 254.04,118.63 253.63,118.23 R_LED11.2
NETLED13_2: length 2.7
  Bottom Layer w0.178: LED13.2 R_LED13.1
NETLED13_4: length 11
  Bottom Layer w0.178: LED13.4 273.09,118.63 272.68,118.23 R_LED12.2
NETLED14_2: length 2.6
  Bottom Layer w0.178: LED14.2 R_LED14.1
NETLED14_4: length 18.3
  Bottom Layer w0.178: LED14.4 295.45,118.63 292.26,121.82 287.54,121.82 283.94,118.23 R_LED13.2
NETLED15_2: length 30.1
  Bottom Layer w0.178: R_LED15.1 324.64,94.42 328.05,97.83 328.05,114.31 322.22,120.13 LED15.2
NETLED15_4: length 11
  Bottom Layer w0.178: R_LED14.2 315.54,118.23 315.95,118.63 LED15.4
NETLED16_2: length 11.5
  Bottom Layer w0.178: R_LED16.1 314.27,93.14 315.95,94.82 LED16.2
NETLED16_4: length 2.6
  Bottom Layer w0.178: LED16.4 R_LED15.2
NETLED17_2: length 25.9
  Bottom Layer w0.178: LED17.2 296.9,94.82 295.91,93.83 272.52,93.83 R_LED17.1
NETLED17_4: length 3.2
  Bottom Layer w0.178: R_LED16.2 305.28,95.04 304,96.32 LED17.4
NETLED18_2: length 21.1
  Bottom Layer w0.178: R_LED18.1 261.88,93.14 263.56,94.82 LED18.2
NETLED18_4: length 2.4
  Bottom Layer w0.178: LED18.4 R_LED17.2
NETLED19_2: length 11.7
  Bottom Layer w0.178: R_LED19.1 233.31,93.14 234.99,94.82 LED19.2
NETLED19_4: length 3.1
  Bottom Layer w0.178: LED19.4 242.04,96.32 243.32,95.04 R_LED18.2
NETLED20_2: length 11.5
  Bottom Layer w0.178: R_LED20.1 214.26,93.14 215.94,94.82 LED20.2
NETLED20_4: length 3
  Bottom Layer w0.178: R_LED19.2 224.12,95.04 223.71,95.45 223.71,95.5 222.89,96.32 LED20.4
NETLED21_2: length 11
  Bottom Layer w0.178: LED21.2 196.89,94.82 196.48,94.42 R_LED21.1
NETLED21_4: length 3.2
  Bottom Layer w0.178: LED21.4 203.97,96.32 205.25,95.04 R_LED20.2
NETLED22_2: length 11.6
  Bottom Layer w0.178: R_LED22.1 176.16,93.14 177.84,94.82 LED22.2
NETLED22_4: length 2.6
  Bottom Layer w0.178: LED22.4 R_LED21.2
NETLED23_2: length 11.6
  Bottom Layer w0.178: LED23.2 158.78,94.82 157.11,93.14 R_LED23.1
NETLED23_4: length 3.1
  Bottom Layer w0.178: R_LED22.2 167.07,95.04 165.79,96.32 LED23.4
NETLED24_2: length 11
  Bottom Layer w0.178: R_LED24.1 139.33,94.42 139.74,94.82 LED24.2
NETLED24_4: length 3.1
  Bottom Layer w0.178: LED24.4 146.73,96.32 148,95.04 R_LED23.2
NETLED25_2: length 11.6
  Bottom Layer w0.178: R_LED25.1 119.01,93.14 120.69,94.82 LED25.2
NETLED25_4: length 2.7
  Bottom Layer w0.178: LED25.4 R_LED24.2
NETLED26_2: length 11.6
  Bottom Layer w0.178: R_LED26.1 99.96,93.14 101.64,94.82 LED26.2
NETLED26_4: length 3.1
  Bottom Layer w0.178: LED26.4 108.67,96.32 109.95,95.04 R_LED25.2
NETLED27_2: length 11.5
  Bottom Layer w0.178: R_LED27.1 80.91,93.14 82.59,94.82 82.92,94.82
NETLED27_4: length 3.1
  Bottom Layer w0.178: LED27.4 89.63,96.32 90.91,95.04 R_LED26.2
NETLED28_2: length 11.6
  Bottom Layer w0.178: R_LED28.1 61.86,93.14 63.53,94.82 LED28.2
NETLED28_4: length 3.2
  Bottom Layer w0.178: R_LED27.2 71.95,95.04 70.67,96.32 LED28.4
NETLED29_2: length 11.2
  Bottom Layer w0.178: LED29.2 44.48,94.82 44.08,94.42 R_LED29.1
NETLED29_4: length 3.1
  Bottom Layer w0.178: R_LED28.2 52.77,95.04 51.5,96.32 LED29.4
NETLED30_2: length 11
  Bottom Layer w0.178: LED30.2 25.43,94.82 25.03,94.42 R_LED30.1
NETLED30_4: length 2.4
  Bottom Layer w0.178: LED30.4 R_LED29.2
NETLED31_2: length 2.4
  Bottom Layer w0.178: R_LED31.1 LED31.2
NETLED31_4: length 2.6
  Bottom Layer w0.178: 12.32,96.32 R_LED30.2
NETLED32_2: length 2.5
  Bottom Layer w0.178: LED32.2 R_LED32.1
NETLED32_4: length 20.4
  Bottom Layer w0.178: LED32.4 11.15,75.77 9.7,77.22 9.7,86.28 6.33,89.64 6.33,89.78 6.34,89.78 6.34,91.14 4.56,92.92 R_LED31.2
NETLED33_2: length 2.6
  Bottom Layer w0.178: LED33.2 R_LED33.1
NETLED33_4: length 15.9
  Bottom Layer w0.178: R_LED32.2 34.56,75.37 34.96,75.77 35.3,75.77
NETLED34_2: length 2.5
  Bottom Layer w0.178: LED34.2 R_LED34.1
NETLED34_4: length 11
  Bottom Layer w0.178: LED34.4 54.01,75.77 53.61,75.37 R_LED33.2
NETLED35_2: length 2.5
  Bottom Layer w0.178: LED35.2 R_LED35.1
NETLED35_4: length 11.1
  Bottom Layer w0.178: LED35.4 73.06,75.77 72.66,75.37 R_LED34.2
NETLED36_2: length 2.4
  Bottom Layer w0.178: LED36.2 R_LED36.1
NETLED36_4: length 11.1
  Bottom Layer w0.178: LED36.4 92.11,75.77 91.71,75.37 R_LED35.2
NETLED37_2: length 2.6
  Bottom Layer w0.178: LED37.2 R_LED37.1
NETLED37_4: length 11.2
  Bottom Layer w0.178: R_LED36.2 110.76,75.37 111.16,75.77 LED37.4
NETLED38_2: length 2.6
  Bottom Layer w0.178: LED38.2 R_LED38.1
NETLED38_4: length 11
  Bottom Layer w0.178: R_LED37.2 129.81,75.37 130.21,75.77 130.55,75.77
NETLED39_2: length 2.6
  Bottom Layer w0.178: LED39.2 R_LED39.1
NETLED39_4: length 11
  Bottom Layer w0.178: R_LED38.2 148.86,75.37 149.26,75.77 LED39.4
NETLED40_2: length 2.6
  Bottom Layer w0.178: LED40.2 R_LED40.1
NETLED40_4: length 11.1
  Bottom Layer w0.178: R_LED39.2 167.91,75.37 168.31,75.77 168.65,75.77
NETLED41_2: length 2.5
  Bottom Layer w0.178: LED41.2 R_LED41.1
NETLED41_4: length 11
  Bottom Layer w0.178: R_LED40.2 186.96,75.37 187.36,75.77 LED41.4
NETLED42_2: length 2.6
  Bottom Layer w0.178: 212.35,77.27 R_LED42.1
NETLED42_4: length 11.1
  Bottom Layer w0.178: R_LED41.2 206.01,75.37 206.41,75.77 LED42.4
NETLED43_2: length 2.5
  Bottom Layer w0.178: LED43.2 R_LED43.1
NETLED43_4: length 11.1
  Bottom Layer w0.178: LED43.4 225.46,75.77 225.06,75.37 R_LED42.2
NETLED44_2: length 2.5
  Bottom Layer w0.178: LED44.2 R_LED44.1
NETLED44_4: length 11.2
  Bottom Layer w0.178: LED44.4 244.45,75.37 R_LED43.2
NETLED45_2: length 2.5
  Bottom Layer w0.178: LED45.2 R_LED45.1
NETLED45_4: length 15.9
  Bottom Layer w0.178: LED45.4 268.32,75.77 267.92,75.37 R_LED44.2
NETLED46_2: length 2.5
  Bottom Layer w0.178: LED46.2 R_LED46.1
NETLED46_4: length 20.9
  Bottom Layer w0.178: R_LED45.2 286,75.37 286.6,75.97 297.03,75.97 LED46.4
NETLED47_2: length 70.8
  Top Layer w0.178: v1(279.59,57.92) 279.59,63.14 v1(280.31,63.86)
  Bottom Layer w0.178: R_LED47.1 270.12,56.73 278.4,56.73 v1(279.59,57.92) ; v1(280.31,63.86) 281.29,63.86 281.65,63.5 317.83,63.5 320.16,65.83 320.16,69.06 322.46,71.36 322.46,72.63 323.09,73.27 323.09,76.4 322.22,77.27
NETLED47_4: length 11.1
  Bottom Layer w0.178: R_LED46.2 315.54,75.37 315.95,75.77 LED47.4
NETLED48_2: length 23
  Bottom Layer w0.178: LED48.2 261.18,56.72 260.78,56.32 R_LED48.1
NETLED48_4: length 2.6
  Bottom Layer w0.178: LED48.4 R_LED47.2
NETLED49_2: length 11.1
  Bottom Layer w0.178: R_LED49.1 229.82,56.32 230.22,56.72 LED49.2
NETLED49_4: length 2.5
  Bottom Layer w0.178: LED49.4 R_LED48.2
NETLED50_2: length 11
  Bottom Layer w0.178: LED50.2 211.17,56.72 210.77,56.32 R_LED50.1
NETLED50_4: length 2.5
  Bottom Layer w0.178: LED50.4 R_LED49.2
NETLED51_2: length 11.1
  Bottom Layer w0.178: R_LED51.1 191.72,56.32 192.12,56.72 LED51.2
NETLED51_4: length 2.7
  Bottom Layer w0.178: LED51.4 R_LED50.2
NETLED52_2: length 11.2
  Bottom Layer w0.178: LED52.2 173.07,56.72 172.67,56.32 R_LED52.1
NETLED52_4: length 2.5
  Bottom Layer w0.178: LED52.4 R_LED51.2
NETLED53_2: length 11.2
  Bottom Layer w0.178: LED53.2 154.02,56.72 153.62,56.32 R_LED53.1
NETLED53_4: length 2.4
  Bottom Layer w0.178: LED53.4 R_LED52.2
NETLED54_2: length 11.1
  Bottom Layer w0.178: R_LED54.1 134.57,56.32 134.97,56.72 LED54.2
NETLED54_4: length 2.5
  Bottom Layer w0.178: LED54.4 R_LED53.2
